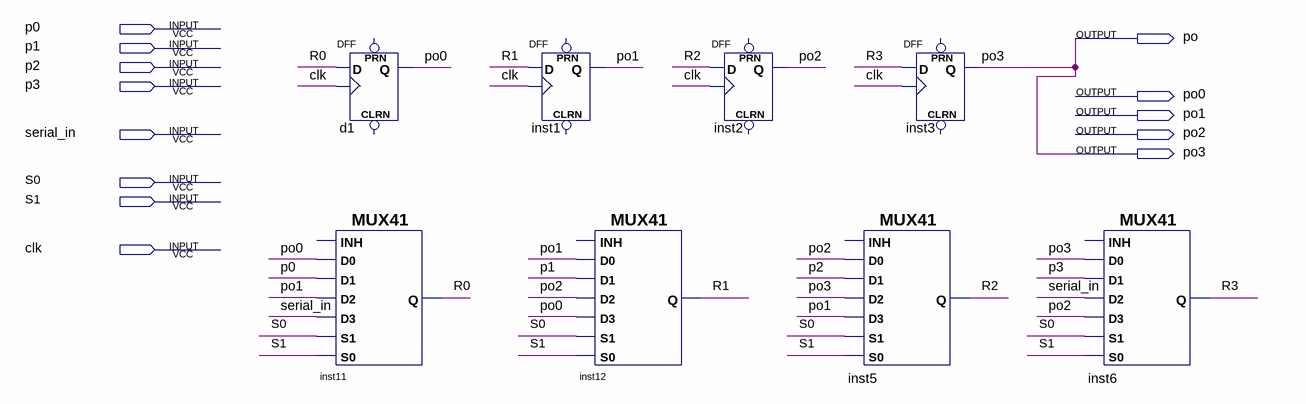
[diagram p0: schematic sheet]
// Quartus schematic CAPR1.bdf as structural Verilog: 8 symbols, 13 pins
module CAPR1 (
  input  p0,
  input  p1,
  input  p2,
  input  p3,
  input  serial_in,
  input  S0,
  input  S1,
  input  clk,
  output po,
  output po0,
  output po1,
  output po2,
  output po3
);

  wire R0, R1, R2, R3;

  DFF d1 (.CLK(clk), .D(R0), .Q(po0));  // open: CLRN, PRN
  MUX41 inst11 (.S0(S1), .D2(po1), .S1(S0), .D3(serial_in), .D0(po0), .D1(p0), .Q(R0));  // open: INH
  DFF inst1 (.CLK(clk), .D(R1), .Q(po1));  // open: CLRN, PRN
  MUX41 inst12 (.S0(S1), .D2(po2), .S1(S0), .D3(po0), .D0(po1), .D1(p1), .Q(R1));  // open: INH
  DFF inst2 (.CLK(clk), .D(R2), .Q(po2));  // open: CLRN, PRN
  MUX41 inst5 (.S0(S1), .D2(po), .S1(S0), .D3(po1), .D0(po2), .D1(p2), .Q(R2));  // open: INH
  DFF inst3 (.CLK(clk), .D(R3), .Q(po));  // open: CLRN, PRN
  MUX41 inst6 (.S0(S1), .D2(serial_in), .S1(S0), .D3(po2), .D0(po), .D1(p3), .Q(R3));  // open: INH

  assign po3 = po;
endmodule
